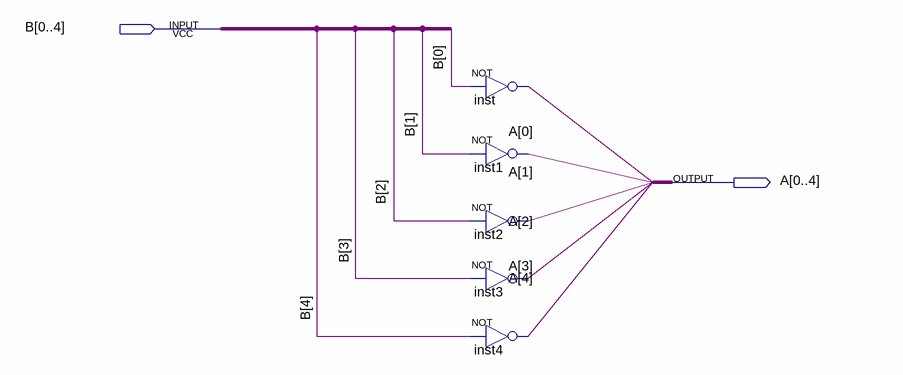
[diagram p0: schematic sheet]
// Quartus schematic not5.bdf as structural Verilog: 5 symbols, 2 pins
module not5 (
  input  [0:4] B,
  output [0:4] A
);

  not inst (A[0], B[0]);
  not inst1 (A[1], B[1]);
  not inst2 (A[2], B[2]);
  not inst3 (A[3], B[3]);
  not inst4 (A[4], B[4]);
endmodule
